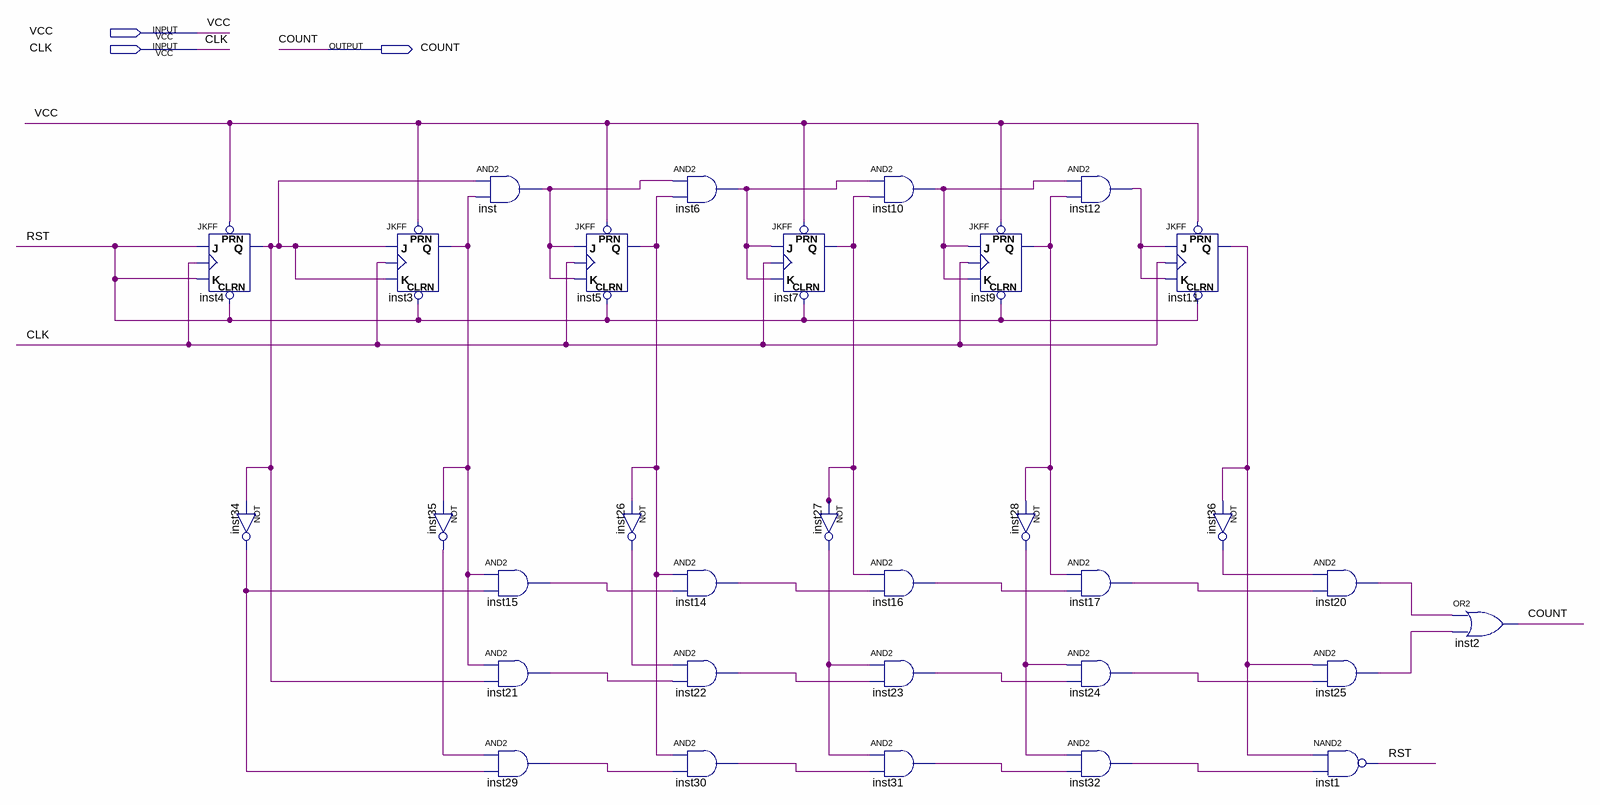
[diagram p0: schematic sheet]
// Quartus schematic Contador35.bdf as structural Verilog: 32 symbols, 3 pins
module Contador35 (
  input  VCC,
  input  CLK,
  output COUNT
);

  wire inst3_q, inst4_q, inst5_q, inst6_out, inst7_q, inst9_q, inst10_out, inst11_q, inst12_out, inst14_out,
       inst15_out, inst16_out, inst17_out, inst20_out, inst21_out, inst22_out, inst23_out, inst24_out,
       inst25_out, inst26_out, inst27_out, inst28_out, inst29_out, inst30_out, inst31_out, inst32_out,
       inst34_out, inst35_out, inst36_out, inst_out, RST;

  JKFF inst4 (.PRN(VCC), .CLRN(RST), .K(RST), .J(RST), .CLK(CLK), .Q(inst4_q));
  not inst34 (inst34_out, inst4_q);
  JKFF inst3 (.PRN(VCC), .CLRN(RST), .K(inst4_q), .J(inst4_q), .CLK(CLK), .Q(inst3_q));
  not inst35 (inst35_out, inst3_q);
  and inst (inst_out, inst4_q, inst3_q);
  and inst15 (inst15_out, inst3_q, inst34_out);
  and inst21 (inst21_out, inst3_q, inst4_q);
  and inst29 (inst29_out, inst35_out, inst34_out);
  JKFF inst5 (.PRN(VCC), .CLRN(RST), .K(inst_out), .J(inst_out), .CLK(CLK), .Q(inst5_q));
  not inst26 (inst26_out, inst5_q);
  and inst6 (inst6_out, inst_out, inst5_q);
  and inst14 (inst14_out, inst5_q, inst15_out);
  and inst22 (inst22_out, inst26_out, inst21_out);
  and inst30 (inst30_out, inst5_q, inst29_out);
  JKFF inst7 (.PRN(VCC), .CLRN(RST), .K(inst6_out), .J(inst6_out), .CLK(CLK), .Q(inst7_q));
  not inst27 (inst27_out, inst7_q);
  and inst10 (inst10_out, inst6_out, inst7_q);
  and inst16 (inst16_out, inst7_q, inst14_out);
  and inst23 (inst23_out, inst27_out, inst22_out);
  and inst31 (inst31_out, inst27_out, inst30_out);
  JKFF inst9 (.PRN(VCC), .CLRN(RST), .K(inst10_out), .J(inst10_out), .CLK(CLK), .Q(inst9_q));
  not inst28 (inst28_out, inst9_q);
  and inst12 (inst12_out, inst10_out, inst9_q);
  and inst17 (inst17_out, inst9_q, inst16_out);
  and inst24 (inst24_out, inst28_out, inst23_out);
  and inst32 (inst32_out, inst28_out, inst31_out);
  JKFF inst11 (.PRN(VCC), .CLRN(RST), .K(inst12_out), .J(inst12_out), .CLK(CLK), .Q(inst11_q));
  not inst36 (inst36_out, inst11_q);
  and inst20 (inst20_out, inst36_out, inst17_out);
  and inst25 (inst25_out, inst11_q, inst24_out);
  nand inst1 (RST, inst11_q, inst32_out);
  or inst2 (COUNT, inst20_out, inst25_out);
endmodule
